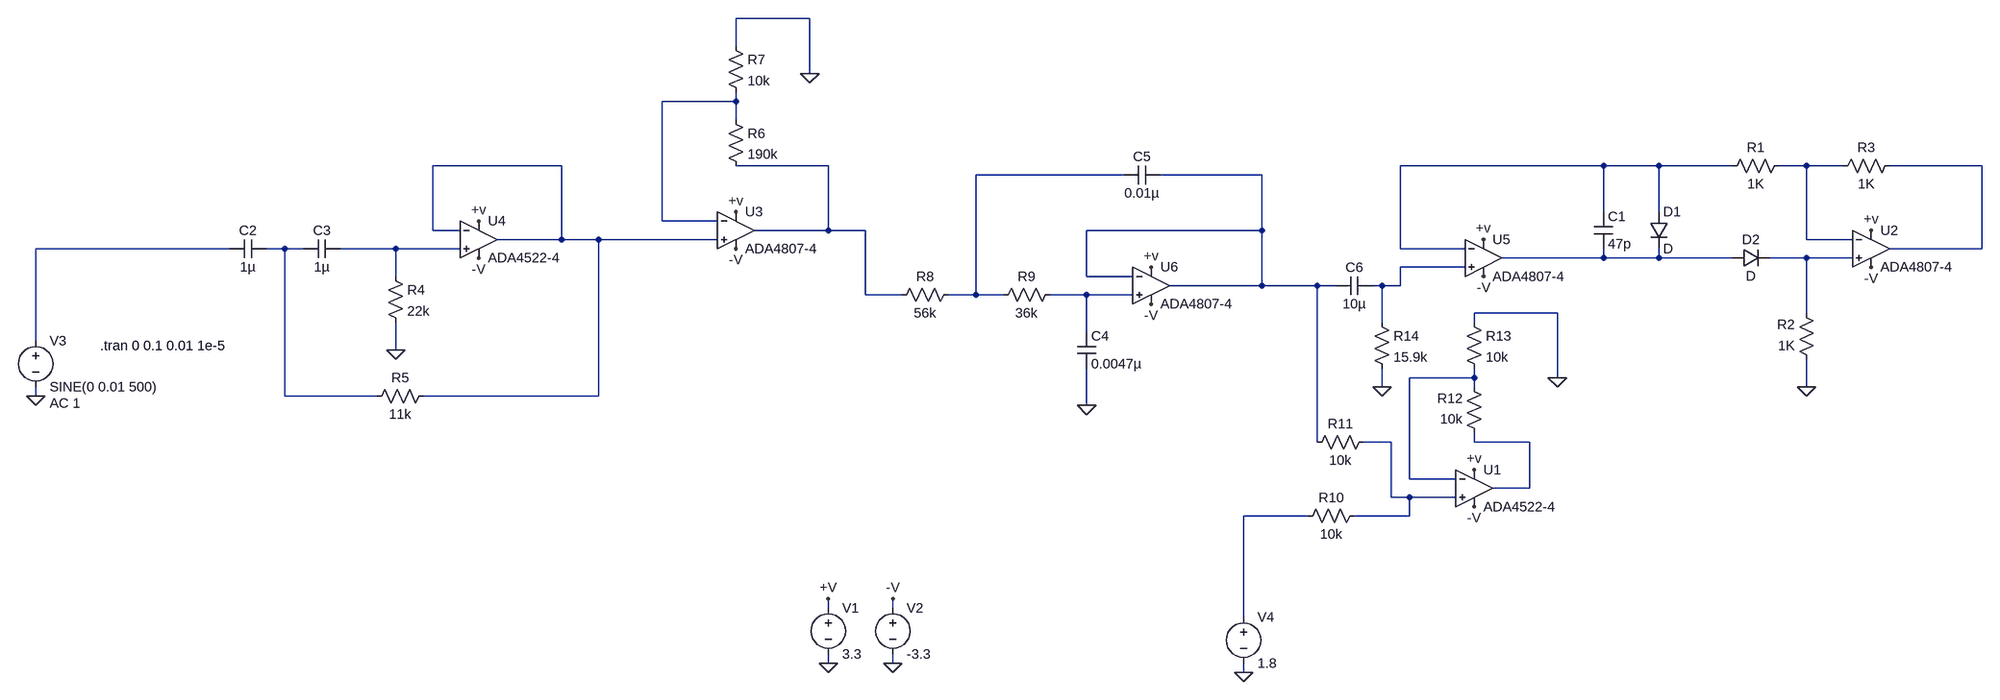
[diagram p0: schematic EMG_BCI.asc]
EMG_BCI.asc, the LTspice schematic file:
Version 4.1
SHEET 1 1140 868
WIRE -896 -288 -1024 -288
WIRE -1024 -240 -1024 -288
WIRE -896 -192 -896 -288
WIRE -1024 -144 -1024 -160
WIRE -1024 -144 -1152 -144
WIRE -1024 -112 -1024 -144
WIRE -1376 -32 -1600 -32
WIRE -864 -32 -1024 -32
WIRE 480 -32 128 -32
WIRE 576 -32 480 -32
WIRE 704 -32 576 -32
WIRE 832 -32 784 -32
WIRE 896 -32 832 -32
WIRE 1136 -32 976 -32
WIRE -352 -16 -608 -16
WIRE -112 -16 -288 -16
WIRE 480 48 480 -32
WIRE 576 48 576 -32
WIRE -1152 64 -1152 -144
WIRE -1056 64 -1152 64
WIRE -1600 80 -1600 -32
WIRE -1552 80 -1600 80
WIRE -864 80 -864 -32
WIRE -864 80 -992 80
WIRE -800 80 -864 80
WIRE -112 80 -112 -16
WIRE -112 80 -416 80
WIRE -1376 96 -1376 -32
WIRE -1376 96 -1488 96
WIRE -1312 96 -1376 96
WIRE -1056 96 -1312 96
WIRE 832 96 832 -32
WIRE 912 96 832 96
WIRE -1952 112 -2288 112
WIRE -1856 112 -1888 112
WIRE -1824 112 -1856 112
WIRE -1664 112 -1760 112
WIRE -1552 112 -1664 112
WIRE 128 112 128 -32
WIRE 240 112 128 112
WIRE 1136 112 1136 -32
WIRE 1136 112 976 112
WIRE 480 128 480 112
WIRE 480 128 304 128
WIRE 576 128 576 112
WIRE 576 128 480 128
WIRE 704 128 576 128
WIRE 832 128 768 128
WIRE 912 128 832 128
WIRE 240 144 128 144
WIRE -1664 160 -1664 112
WIRE -416 160 -416 80
WIRE -336 160 -416 160
WIRE -112 176 -112 80
WIRE -112 176 -272 176
WIRE -16 176 -112 176
WIRE 16 176 -16 176
WIRE 96 176 80 176
WIRE 128 176 128 144
WIRE 128 176 96 176
WIRE -800 192 -800 80
WIRE -736 192 -800 192
WIRE -608 192 -608 -16
WIRE -608 192 -656 192
WIRE -560 192 -608 192
WIRE -416 192 -480 192
WIRE -336 192 -416 192
WIRE 400 224 256 224
WIRE 832 224 832 128
WIRE 96 240 96 176
WIRE 256 240 256 224
WIRE -416 256 -416 192
WIRE -2288 272 -2288 112
WIRE -1664 288 -1664 240
WIRE 256 336 256 320
WIRE 256 336 144 336
WIRE 400 336 400 224
WIRE 96 352 96 320
WIRE 256 352 256 336
WIRE 832 352 832 304
WIRE -2288 368 -2288 352
WIRE -1856 368 -1856 112
WIRE -1696 368 -1856 368
WIRE -1312 368 -1312 96
WIRE -1312 368 -1616 368
WIRE -416 384 -416 320
WIRE -16 448 -16 176
WIRE 112 448 64 448
WIRE 256 448 256 432
WIRE 352 448 256 448
WIRE 144 512 144 336
WIRE 224 512 144 512
WIRE 352 528 352 448
WIRE 352 528 288 528
WIRE 112 544 112 448
WIRE 144 544 112 544
WIRE 224 544 144 544
WIRE -32 576 -144 576
WIRE 144 576 144 544
WIRE 144 576 48 576
WIRE -864 736 -864 720
WIRE -752 736 -752 720
WIRE -144 752 -144 576
WIRE -864 832 -864 816
WIRE -752 832 -752 816
WIRE -144 848 -144 832
FLAG -864 720 +V
FLAG -864 832 0
FLAG -752 720 -V
FLAG -752 832 0
FLAG 832 352 0
FLAG -2288 368 0
FLAG 272 96 +v
FLAG 944 80 +v
FLAG 272 160 -V
FLAG 944 144 -V
FLAG -1520 64 +v
FLAG -1520 128 -V
FLAG -1024 48 +v
FLAG -1024 112 -V
FLAG -1664 288 0
FLAG -896 -192 0
FLAG -304 144 +v
FLAG -304 208 -V
FLAG -416 384 0
FLAG 256 496 +v
FLAG 256 560 -V
FLAG -144 848 0
FLAG 400 336 0
FLAG 96 352 0
SYMBOL voltage -864 720 R0
WINDOW 123 0 0 Left 0
WINDOW 39 0 0 Left 0
SYMATTR InstName V1
SYMATTR Value 3.3
SYMBOL voltage -752 720 R0
WINDOW 123 0 0 Left 0
WINDOW 39 0 0 Left 0
SYMATTR InstName V2
SYMATTR Value -3.3
SYMBOL cap 464 48 R0
SYMATTR InstName C1
SYMATTR Value 47p
SYMBOL diode 560 48 R0
SYMATTR InstName D1
SYMBOL diode 704 144 R270
WINDOW 0 32 32 VTop 2
WINDOW 3 0 32 VBottom 2
SYMATTR InstName D2
SYMBOL OpAmps\\ADA4807-4 944 48 R0
SYMATTR InstName U2
SYMBOL res 800 -48 R90
WINDOW 0 0 56 VBottom 2
WINDOW 3 32 56 VTop 2
SYMATTR InstName R1
SYMATTR Value 1K
SYMBOL res 848 320 R180
WINDOW 0 36 76 Left 2
WINDOW 3 36 40 Left 2
SYMATTR InstName R2
SYMATTR Value 1K
SYMBOL res 880 -16 R270
WINDOW 0 32 56 VTop 2
WINDOW 3 0 56 VBottom 2
SYMATTR InstName R3
SYMATTR Value 1K
SYMBOL voltage -2288 256 R0
WINDOW 123 24 124 Left 2
WINDOW 39 24 125 Left 2
SYMATTR Value2 AC 1
SYMATTR InstName V3
SYMATTR Value SINE(0 0.01 500)
SYMBOL OpAmps\\ADA4807-4 272 64 R0
SYMATTR InstName U5
SYMBOL OpAmps\\ADA4807-4 -1024 16 R0
SYMATTR InstName U3
SYMBOL cap -1888 96 R90
WINDOW 0 0 32 VBottom 2
WINDOW 3 32 32 VTop 2
SYMATTR InstName C2
SYMATTR Value 1µ
SYMBOL cap -1760 96 R90
WINDOW 0 0 32 VBottom 2
WINDOW 3 32 32 VTop 2
SYMATTR InstName C3
SYMATTR Value 1µ
SYMBOL res -1680 144 R0
SYMATTR InstName R4
SYMATTR Value 22k
SYMBOL res -1600 352 R90
WINDOW 0 0 56 VBottom 2
WINDOW 3 32 56 VTop 2
SYMATTR InstName R5
SYMATTR Value 11k
SYMBOL res -1040 -128 R0
SYMATTR InstName R6
SYMATTR Value 190k
SYMBOL res -1040 -256 R0
SYMATTR InstName R7
SYMATTR Value 10k
SYMBOL OpAmps\\ADA4807-4 -304 112 R0
SYMATTR InstName U6
SYMBOL res -640 176 R90
WINDOW 0 0 56 VBottom 2
WINDOW 3 32 56 VTop 2
SYMATTR InstName R8
SYMATTR Value 56k
SYMBOL res -464 176 R90
WINDOW 0 0 56 VBottom 2
WINDOW 3 32 56 VTop 2
SYMATTR InstName R9
SYMATTR Value 36k
SYMBOL cap -432 256 R0
SYMATTR InstName C4
SYMATTR Value 0.0047µ
SYMBOL cap -288 -32 R90
WINDOW 0 0 32 VBottom 2
WINDOW 3 32 32 VTop 2
SYMATTR InstName C5
SYMATTR Value 0.01µ
SYMBOL OpAmps\\ADA4522-4 -1520 32 R0
SYMATTR InstName U4
SYMBOL OpAmps\\ADA4522-4 256 464 R0
SYMATTR InstName U1
SYMBOL res 64 560 R90
WINDOW 0 0 56 VBottom 2
WINDOW 3 32 56 VTop 2
SYMATTR InstName R10
SYMATTR Value 10k
SYMBOL voltage -144 736 R0
WINDOW 123 0 0 Left 0
WINDOW 39 0 0 Left 0
SYMATTR InstName V4
SYMATTR Value 1.8
SYMBOL res 80 432 R90
WINDOW 0 0 56 VBottom 2
WINDOW 3 32 56 VTop 2
SYMATTR InstName R11
SYMATTR Value 10k
SYMBOL res 272 448 R180
WINDOW 0 36 76 Left 2
WINDOW 3 36 40 Left 2
SYMATTR InstName R12
SYMATTR Value 10k
SYMBOL res 240 224 R0
SYMATTR InstName R13
SYMATTR Value 10k
SYMBOL cap 80 160 R90
WINDOW 0 0 32 VBottom 2
WINDOW 3 32 32 VTop 2
SYMATTR InstName C6
SYMATTR Value 10µ
SYMBOL res 80 224 R0
SYMATTR InstName R14
SYMATTR Value 15.9k
TEXT -2176 280 Left 2 !.tran 0 0.1 0.01 1e-5

The netlist it stands for:
* EMG_BCI.asc
V1 +V 0 3.3
V2 -V 0 -3.3
C1 N004 N012 47p
D1 N004 N012 D
D2 N012 N013 D
X§U2 N013 N005 +V -V N006 ADA4807-4  ; pins In+ In- V+ V- OUT
R1 N005 N004 1K
R2 0 N013 1K
R3 N005 N006 1K
V3 N009 0 SINE(0 0.01 500) AC 1
X§U5 N014 N004 +V -V N012 ADA4807-4  ; pins In+ In- V+ V- OUT
X§U3 N002 N001 +V -V N003 ADA4807-4  ; pins In+ In- V+ V- OUT
C2 N010 N009 1µ
C3 N011 N010 1µ
R4 N011 0 22k
R5 N002 N010 11k
R6 N001 N003 190k
R7 0 N001 10k
X§U6 N015 N008 +V -V N008 ADA4807-4  ; pins In+ In- V+ V- OUT
R8 N007 N003 56k
R9 N015 N007 36k
C4 N015 0 0.0047µ
C5 N008 N007 0.01µ
X§U4 N011 N002 +V -V N002 ADA4522-4  ; pins In+ In- V+ V- OUT
X§U1 N017 N016 +V -V N018 ADA4522-4  ; pins In+ In- V+ V- OUT
R10 N017 N019 10k
V4 N019 0 1.8
R11 N017 N008 10k
R12 N018 N016 10k
R13 0 N016 10k
C6 N014 N008 10µ
R14 N014 0 15.9k
.model D D
.lib standard.dio
.tran 0 0.1 0.01 1e-5
.backanno
.end